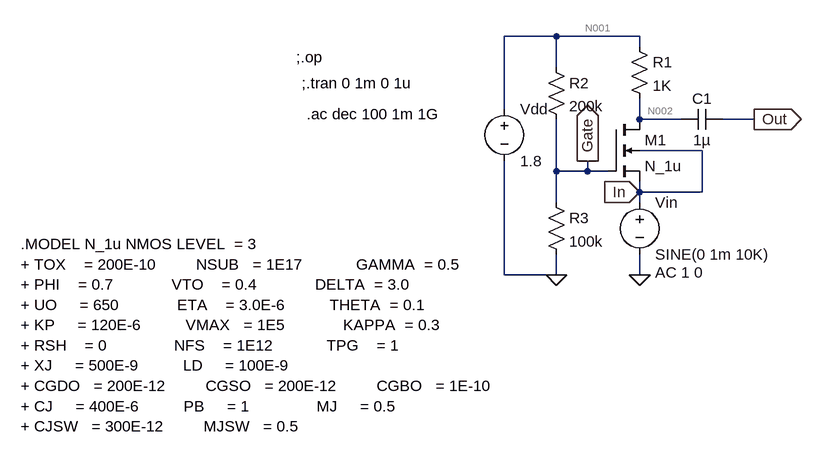
[diagram p0: schematic CGAmp.asc]
CGAmp.asc, the LTspice schematic file:
Version 4
SHEET 1 880 680
WIRE 64 0 -16 0
WIRE 192 0 64 0
WIRE 192 16 192 0
WIRE 64 48 64 0
WIRE -16 112 -16 0
WIRE 192 128 192 96
WIRE 256 128 192 128
WIRE 368 128 320 128
WIRE 288 176 192 176
WIRE 64 208 64 128
WIRE 112 208 112 192
WIRE 112 208 64 208
WIRE 144 208 112 208
WIRE 192 240 192 224
WIRE 288 240 288 176
WIRE 288 240 192 240
WIRE 64 256 64 208
WIRE 192 256 192 240
WIRE -16 368 -16 192
WIRE 64 368 64 336
WIRE 64 368 -16 368
WIRE 192 368 192 336
FLAG 64 368 0
FLAG 368 128 Out
IOPIN 368 128 Out
FLAG 112 192 Gate
IOPIN 112 192 Out
FLAG 192 240 In
IOPIN 192 240 In
FLAG 192 368 0
SYMBOL nmos4 144 128 R0
SYMATTR InstName M1
SYMATTR Value N_1u
SYMATTR Value2 l=1u w=400u
SYMBOL voltage 192 240 R0
WINDOW 123 24 124 Left 2
WINDOW 39 0 0 Left 0
SYMATTR InstName Vin
SYMATTR Value SINE(0 1m 10K)
SYMATTR Value2 AC 1 0
SYMBOL res 176 0 R0
SYMATTR InstName R1
SYMATTR Value 1K
SYMBOL voltage -16 96 R0
WINDOW 123 0 0 Left 0
WINDOW 39 0 0 Left 0
SYMATTR InstName Vdd
SYMATTR Value 1.8
SYMBOL res 48 32 R0
SYMATTR InstName R2
SYMATTR Value 200k
SYMBOL res 48 240 R0
SYMATTR InstName R3
SYMATTR Value 100k
SYMBOL cap 320 112 R90
WINDOW 0 0 32 VBottom 2
WINDOW 3 32 32 VTop 2
SYMATTR InstName C1
SYMATTR Value 1µ
TEXT -760 320 Left 2 !.MODEL N_1u NMOS LEVEL  = 3                  \n+ TOX    = 200E-10         NSUB   = 1E17            GAMMA  = 0.5          \n+ PHI    = 0.7             VTO    = 0.4             DELTA  = 3.0         \n+ UO     = 650             ETA    = 3.0E-6          THETA  = 0.1          \n+ KP     = 120E-6          VMAX   = 1E5             KAPPA  = 0.3                \n+ RSH    = 0               NFS    = 1E12            TPG    = 1                  \n+ XJ     = 500E-9          LD     = 100E-9                 \n+ CGDO   = 200E-12         CGSO   = 200E-12         CGBO   = 1E-10              \n+ CJ     = 400E-6          PB     = 1               MJ     = 0.5           \n+ CJSW   = 300E-12         MJSW   = 0.5
TEXT -336 32 Left 2 !;.op
TEXT -328 72 Left 2 !;.tran 0 1m 0 1u
TEXT -320 120 Left 2 !.ac dec 100 1m 1G

The netlist it stands for:
* CGAmp.asc
M1 N002 Gate In In N_1u l=1u w=400u
Vin In 0 SINE(0 1m 10K) AC 1 0
R1 N001 N002 1K
Vdd N001 0 1.8
R2 N001 Gate 200k
R3 Gate 0 100k
C1 Out N002 1µ
.model NMOS NMOS
.model PMOS PMOS
.lib standard.mos
.MODEL N_1u NMOS LEVEL  = 3
+ TOX    = 200E-10         NSUB   = 1E17            GAMMA  = 0.5
+ PHI    = 0.7             VTO    = 0.4             DELTA  = 3.0
+ UO     = 650             ETA    = 3.0E-6          THETA  = 0.1
+ KP     = 120E-6          VMAX   = 1E5             KAPPA  = 0.3
+ RSH    = 0               NFS    = 1E12            TPG    = 1
+ XJ     = 500E-9          LD     = 100E-9
+ CGDO   = 200E-12         CGSO   = 200E-12         CGBO   = 1E-10
+ CJ     = 400E-6          PB     = 1               MJ     = 0.5
+ CJSW   = 300E-12         MJSW   = 0.5
;.op
;.tran 0 1m 0 1u
.ac dec 100 1m 1G
.backanno
.end

* Results of the author's LTspice run, read from the files saved beside the schematic
* Operating Point, zero values left out:
*   V(n002) = 351.8 mV
*   V(gate) = 600 mV
*   V(n001) = 1.8 V
*   V(out) = 351.8 nV
*   Id(M1) = 1.448 mA
*   Is(M1) = -1.448 mA
*   I(R3) = 6 µA
*   I(R2) = 6 µA
*   I(R1) = 1.448 mA
*   I(Vdd) = -1.454 mA
*   I(Vin) = 1.448 mA
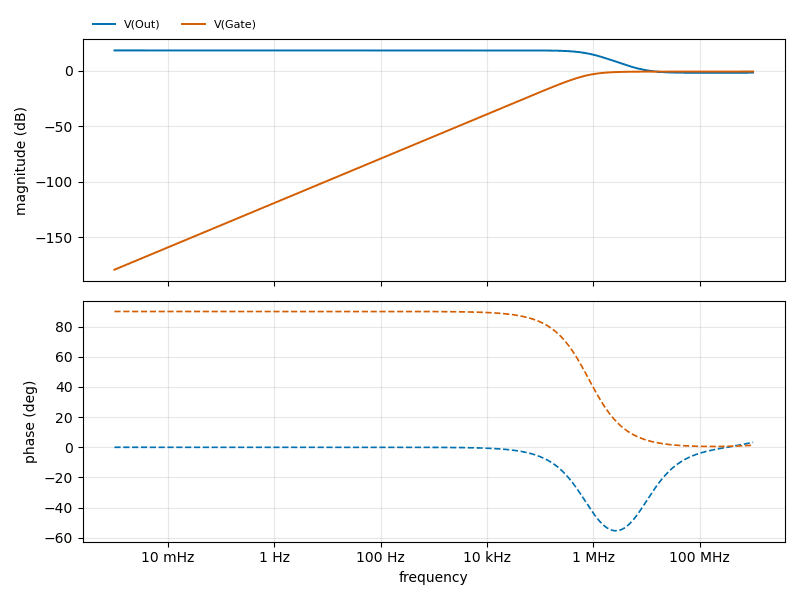
[diagram p1: AC Analysis of CGAmp.asc, plotted from the saved traces]
* AC Analysis, 1 run:
*   V(Out): 18.40 dB at 1 mHz, -1.63 dB at 1 GHz, peak 18.40 dB at 1 mHz, 3 dB below the peak at 831 kHz
*   V(Gate): -178.99 dB at 1 mHz, -0.61 dB at 1 GHz, peak -0.61 dB at 1 GHz, 3 dB below the peak at 835.8 kHz